# EAGLE design FishCaller (EAGLE 7.5.0)
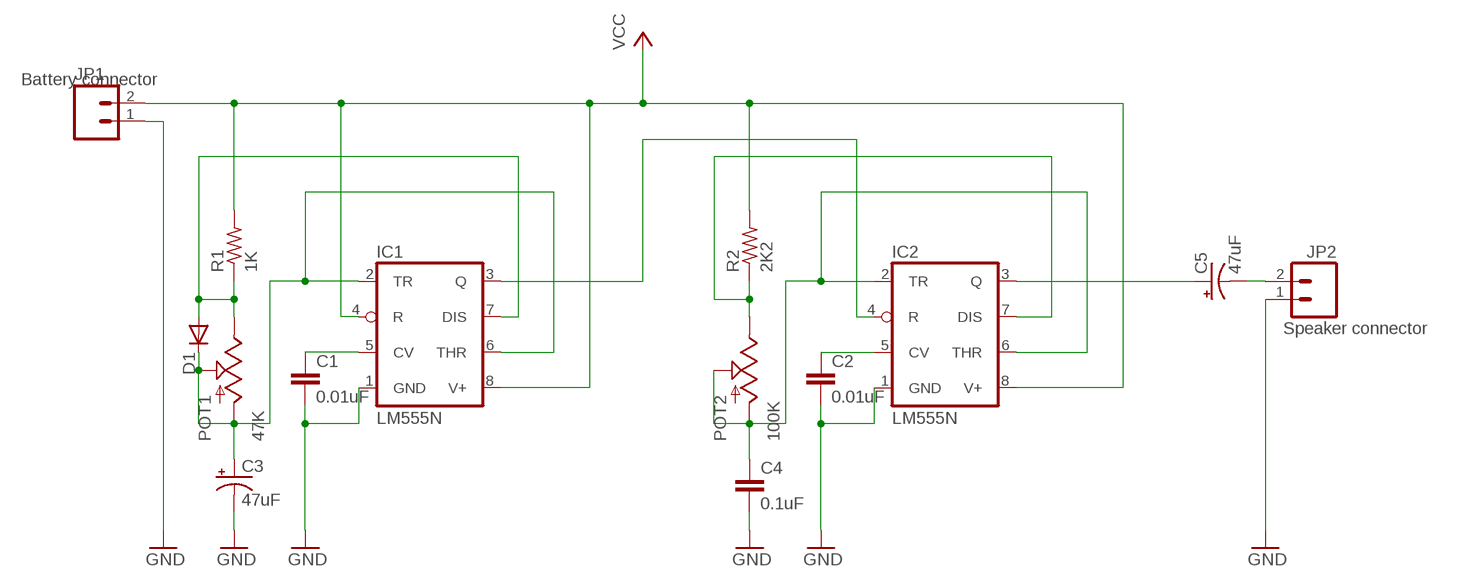
[diagram p0: schematic, sheet 1]

## Parts
C1  0.01uF  CAPPTH  [CAP-PTH-SMALL]
C2  0.01uF  CAPPTH  [CAP-PTH-SMALL]
C3  47uF  CPOL-USE2.5-6  [E2,5-6]
C4  0.1uF  CAPPTH  [CAP-PTH-SMALL]
C5  47uF  CPOL-USE2.5-6  [E2,5-6]
D1  DIODE1N4148  [DIODE-1N4148]
IC1  LM555N  [DIL08-ROUND]
IC2  LM555N  [DIL08-ROUND]
JP1  M02  [1X02_LONGPADS]
JP2  M02  [1X02_LONGPADS]
POT1  47K  POT  [ALPS_POT]
POT2  100K  POT  [ALPS_POT]
R1  1K  R-US_0207/9  [0207/9]
R2  2K2  R-US_0207/9  [0207/9]

## Nets
GND: C1.2 C2.2 C3.- C4.2 IC1.1(GND) IC2.1(GND) JP1.1 JP2.1
N$1: C1.1 IC1.5(CV)
N$2: C2.1 IC2.5(CV)
N$4: IC2.7(DIS) POT2.P$1(E) R2.1
N$5: C3.+ D1.C IC1.2(TR) IC1.6(THR) POT1.P$2(S) POT1.P$3(A)
N$6: D1.A IC1.7(DIS) POT1.P$1(E) R1.1
N$7: C5.+ IC2.3(Q)
N$8: C5.- JP2.2
N$9: C4.1 IC2.2(TR) IC2.6(THR) POT2.P$2(S) POT2.P$3(A)
N$11: IC1.3(Q) IC2.4(R)
VCC: IC1.4(R) IC1.8(V+) IC2.8(V+) JP1.2 R1.2 R2.2

## Notes on the sheet
- Battery connector
- Speaker connector

## Library data of the parts
C1 C2 C4 = SparkFun:CAP: Capacitor Standard 0603 ceramic capacitor, and 0.1" leaded capacitor.
C3 C5 = Robin:CPOL-US: POLARIZED CAPACITOR, American symbol
D1 = SparkFun:DIODE: Diode These are standard reverse protection diodes and small signal diodes. SMA package can handle up to about 1A. SOD-323 can handle about 200mA. What the SOD-323 package when ordering, there are some mfgs out there that are 5-pin packages.
IC1 IC2 = adafruit:*555: TIMER Changed DIP package to have round (not oval) pin pads http://www.ladyada.net/library/pcb/eaglelibrary.html
JP1 JP2 = SparkFun:M02: Header 2 Standard 2-pin 0.1" header. Use with straight break away headers (SKU : PRT-00116), right angle break away headers (PRT-00553), swiss pins (PRT-00743), machine pins (PRT-00117), and female headers (PRT-00115). Molex polarized connector foot print use with SKU : PRT-08233 with associated crimp pins and housings.
POT1 POT2 = SparkFun:POT
R1 R2 = adafruit:R-US_: RESISTOR, American symbol

## Board
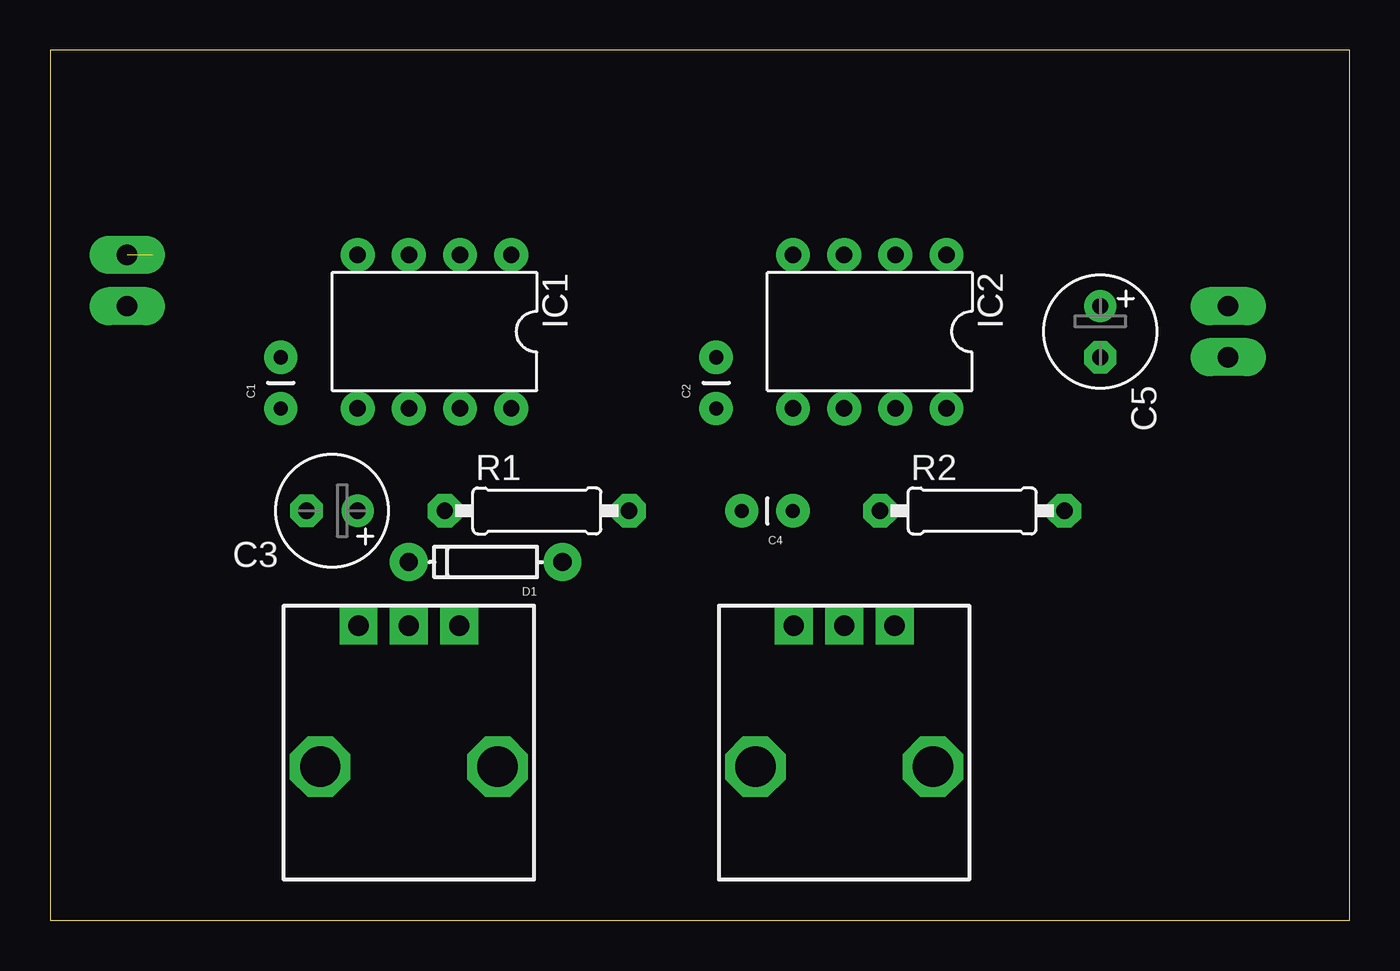
[diagram p1: board, top side]
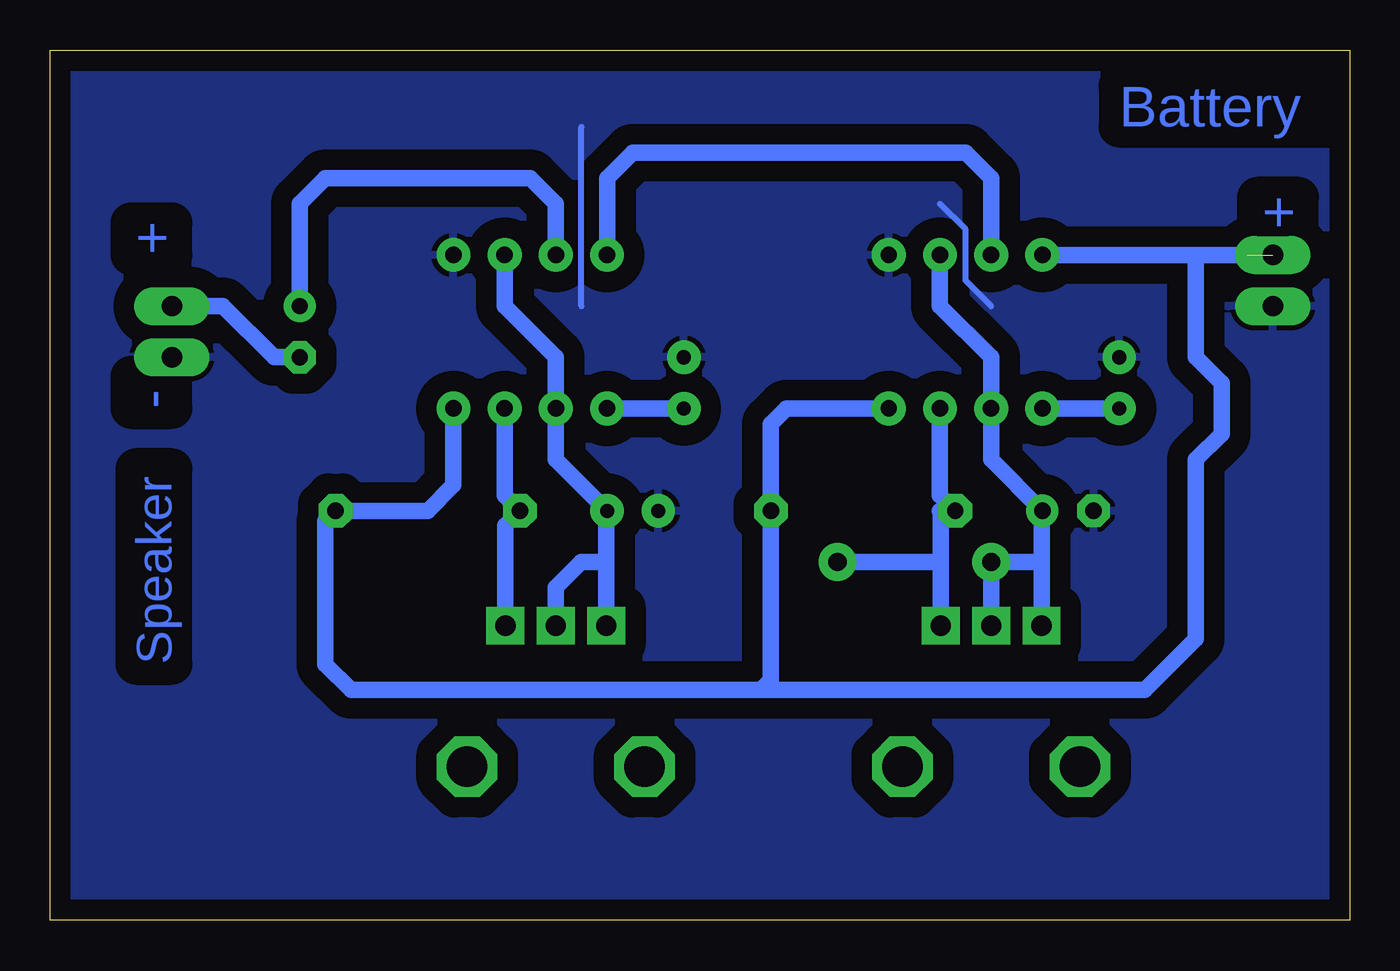
[diagram p2: board, bottom side, seen from below]

Size 64.44 x 43.17 mm. Coordinates in mm from the lower left corner, seen from the top.
Outline: 0,0 64.44,0 64.44,43.17 0,43.17 0,0
Copper layers (1*16): Top 0.035mm / dielectric 1.5mm / Bottom 0.035mm
Design rules "default": minimum track width 10mil, minimum drill 24mil, track to track 8mil, track to pad 8mil, pad to pad 8mil, via to via 8mil, smd to smd 8mil, copper to edge 40mil, drill to drill 8mil, minimum pad ring 10mil, minimum via ring 8mil, stop-mask expansion 4mil, vias tented up to drill 0mil, thermal gap 10mil

### Footprints (pad centres in the part's own frame; a part is rotated, then mirrored left to right if it is on the bottom)
CAP-PTH-SMALL = drill 0.7 pad 1.651: 1 0,0; 2 2.54,0
E2,5-6 = drill 0.813 pad 1.6: + -1.27,0 | drill 0.813 pad 1.6 octagon: - 1.27,0
DIODE-1N4148 = drill 0.9 pad 1.88: A -3.81,0; C 3.81,0
DIL08-ROUND = drill 0.813 pad 1.676: 1 -3.81,-3.81; 2 -1.27,-3.81; 3 1.27,-3.81; 4 3.81,-3.81; 5 3.81,3.81; 6 1.27,3.81; 7 -1.27,3.81; 8 -3.81,3.81
1X02_LONGPADS = drill 1.016 pad 1.88 long: 1 0,0; 2 2.54,0
ALPS_POT = drill 1 pad 1.88 square: P$1 7,-2.5; P$2 7,0; P$3 7,2.5 | drill 2 octagon: P$4 0,-4.4; P$5 0,4.4
0207/9 = drill 0.813 pad 1.676 octagon: 1 -4.572,0; 2 4.572,0

### Placement (x,y rotation side)
C1  11.43,25.4 90 top
C2  33.02,25.4 90 top
C3  13.97,20.32 180 top
C4  36.83,20.32 180 top
C5  52.07,29.21 270 top
D1  21.59,17.78 180 top
IC1  19.05,29.21 180 top
IC2  40.64,29.21 180 top
JP1  3.81,30.48 90 top
JP2  58.42,27.94 90 top
POT1  17.78,7.62 90 top
POT2  39.37,7.62 90 top
R1  24.13,20.32 0 top
R2  45.72,20.32 0 top

### Tracks (layer width: path | path; a pad name or v marks a point on that pad's centre or on a via)
GND
  Bottom 0.305: 17.78,30.48 19.05,31.75 19.05,34.29 20.32,35.56 | 38.1,30.48 38.1,39.37
  pour Bottom (isolate 1.016): -2.54,-1.27 66.04,-1.27 66.04,44.45 -1.27,44.45 -1.27,0
N$1
  Bottom 0.813: IC1.5 C1.1
N$2
  Bottom 0.813: IC2.5 C2.1
N$4
  Bottom 0.813: POT2.P$1 41.87,19.6 R2.1 41.91,21.08 IC2.7
N$5
  Bottom 0.813: IC1.2 20.32,30.48 17.78,27.94 IC1.6 17.78,22.86 C3.+ 15.28,20.32 15.28,17.78 | 15.28,17.78 POT1.P$3 | 15.28,17.78 D1.C POT1.P$2
N$6
  Bottom 0.813: IC1.7 20.32,21.08 R1.1 20.32,20.32 20.28,20.28 20.28,17.78 | POT1.P$1 20.28,17.78 | D1.A 20.28,17.78
N$7
  Bottom 0.813: IC2.3 39.37,35.56 40.64,36.83 50.8,36.83 52.07,35.56 C5.+
N$8
  Bottom 0.813: C5.- 53.34,27.94 55.88,30.48 JP2.2
N$9
  Bottom 0.813: POT2.P$3 36.87,17.78 | 36.87,17.78 36.87,20.28 C4.1 39.37,22.86 IC2.6 39.37,27.94 41.91,30.48 IC2.2 | POT2.P$2 39.37,16.51 38.1,17.78 36.87,17.78
N$11
  Bottom 0.813: IC1.3 17.78,36.83 19.05,38.1 35.56,38.1 36.83,36.83 IC2.4
VCC  (1 unrouted)
  Bottom 0.813: 29.21,11.43 10.16,11.43 7.62,13.97 7.62,22.86 6.35,24.13 6.35,26.67 7.62,27.94 7.62,33.02 | 29.21,11.43 49.53,11.43 50.8,12.7 50.8,19.81 R2.2 45.72,20.32 44.45,21.59 IC2.8 | 29.21,11.43 28.7,11.94 R1.2 28.7,24.64 27.94,25.4 IC1.8 | IC1.4 7.62,33.02 | 7.62,33.02 5.08,33.02

### Text on the board
Bottom: Battery | + | + | - | Speaker